# Altium schematic sheet Holder_PCB_v1.SchDoc
size A4; SheetNumber: 2; SheetTotal: 2
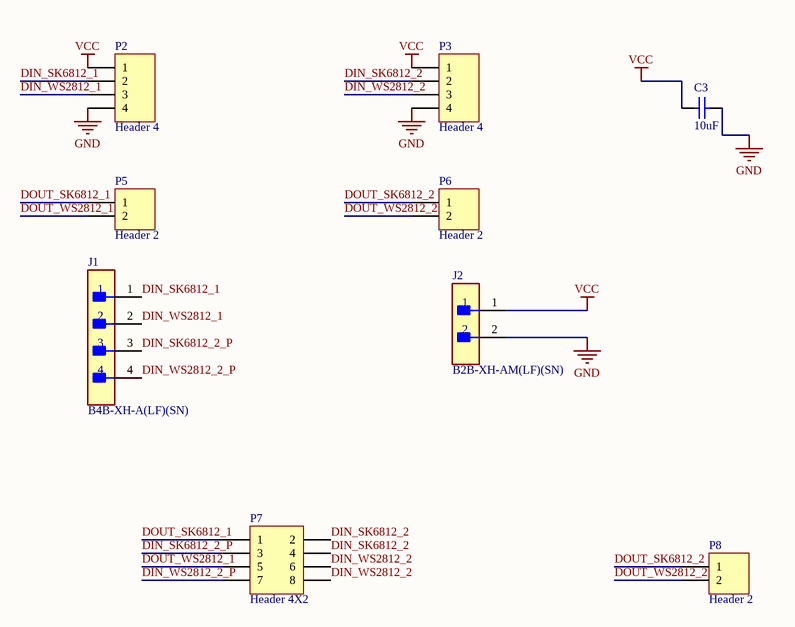
[diagram p0: Holder_PCB_v1.SchDoc]

## Parts
C3  10uF  [0805C]
J1  B4B-XH-A(LF)(SN)  [FP-B4B-XH-A_LF_SN-MFG]
J2  B2B-XH-AM(LF)(SN)  [FP-B2B-XH-AM_LF_SN-MFG]
P2  Header 4  [HDR1X4]
P3  Header 4  [HDR1X4]
P5  Header 2  [HDR1X2]
P6  Header 2  [HDR1X2]
P7  Header 4X2  [HDR2X4]
P8  Header 2  [HDR1X2]

## Nets
GND: C3.1 J2.2 P2.4 P3.4
VCC: C3.2 J2.1 P2.1 P3.1
DIN_SK6812_1: J1.1 P2.2
DIN_SK6812_2: P3.2 P7.2 P7.4
DIN_SK6812_2_P: J1.3 P7.3
DIN_WS2812_1: J1.2 P2.3
DIN_WS2812_2: P3.3 P7.6 P7.8
DIN_WS2812_2_P: J1.4 P7.7
DOUT_SK6812_1: P5.1 P7.1
DOUT_SK6812_2: P6.1 P8.1
DOUT_WS2812_1: P5.2 P7.5
DOUT_WS2812_2: P6.2 P8.2

## Library data of the parts
C3 = C: Capacitor; Reviewed by: RM - 2018/08/05; Revision: July-2002: Re-released for DXP Platform.; Supplier 1: *; Supplier Part Number 1: *; Value: 10uF
J1 = CMP-17439-000250-1: CONN HEADER VERT 4POS 2.5MM; Number of Contacts: 4; Contact Resistance: 20mR; Voltage Rating: 250V; Max Current Rating: 3A; Gender: Male; Wire/Cable Gauge: 22AWG; Mated Stacking Heights: 9.8mm; Insulation Resistance: 1GR; Orientation: Straight; Contact Type: Male Pin; Contact Finish - Mating: TIN; Series: XH; Max Voltage Rating (AC): 250V; Lead Pitch: 2.5mm; Contact Shape: Square; Insulation Color: Natural; Termination: Solder; Lead Free: Lead Free; Voltage Rating (AC): 250V; Number of Rows: 1; Flammability Rating: UL94 V-0; Number of Positions: 4; Max Operating Temperature: 85°C; Package Quantity: 500; Mount: Through Hole; REACH SVHC: No SVHC; Connector Type: Header; Insulation Material: Nylon; Fastening Type: Detent; Min Operating Temperature: -25°C; Housing Color: White; Packaging: Bulk; Contact Plating: Tin; Contact Material: Brass; Max Voltage Rating (DC): 250V; Housing Material: Polyamide; Color: Natural; Material: Polyamide; Pitch: 2.5mm; Depth: 5.75mm; Current Rating: 3A; Length: 12.4mm
J2 = CMP-17439-000037-1: CONN HEADER VERT 2POS 2.5MM; Max Voltage Rating (AC): 250V; Connector Type: Male Pin; Contact Resistance: 20mR; Max Current Rating: 3A; Number of Positions: 2; Series: XH; Contact Material: Brass; Mount: Through Hole; Housing Material: Polyamide; Contact Plating: Tin; Termination: Solder; Max Operating Temperature: 85°C; Depth: 5.75mm; Packaging: Bulk; Min Operating Temperature: -25°C; Contact Type: Male Pin; Color: Green; Pitch: 2.5mm; Length: 7.4mm; Lead Free: Lead Free; Number of Rows: 1; Fastening Type: Detent; Housing Color: White; Orientation: Straight
P2 P3 = Header 4: Header, 4-Pin; LatestRevisionDate: 17-Jul-2002; LatestRevisionNote: Re-released for DXP Platform.; Publisher: Altium Limited
P5 P6 P8 = Header 2: Header, 2-Pin; LatestRevisionDate: 17-Jul-2002; LatestRevisionNote: Re-released for DXP Platform.; Publisher: Altium Limited
P7 = Header 4X2: Header, 4-Pin, Dual row; LatestRevisionDate: 17-Jul-2002; LatestRevisionNote: Re-released for DXP Platform.; Publisher: Altium Limited